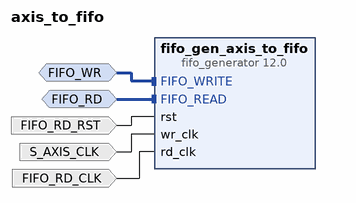
[diagram p0: block diagram of the top level]
# Vivado block design axis_to_fifo, Vivado 2014.4
create_bd_design axis_to_fifo

create_bd_intf_port -mode Slave -vlnv xilinx.com:interface:fifo_write_rtl:1.0 FIFO_WR
create_bd_intf_port -mode Slave -vlnv xilinx.com:interface:fifo_read_rtl:1.0 FIFO_RD
create_bd_port -dir I FIFO_RD_RST
create_bd_port -dir I S_AXIS_CLK
create_bd_port -dir I FIFO_RD_CLK

create_bd_cell -type ip -vlnv xilinx.com:ip:fifo_generator:12.0 fifo_gen_axis_to_fifo
set_property -dict [list \
  CONFIG.Fifo_Implementation Independent_Clocks_Block_RAM \
  CONFIG.synchronization_stages 3 \
  CONFIG.Input_Data_Width 32 \
  CONFIG.Output_Data_Width 32 \
  CONFIG.Full_Flags_Reset_Value 1 \
  CONFIG.Use_Dout_Reset true \
] [get_bd_cells fifo_gen_axis_to_fifo]

# ---- connections ----

connect_bd_intf_net [get_bd_intf_ports FIFO_WR] [get_bd_intf_pins fifo_gen_axis_to_fifo/FIFO_WRITE]
connect_bd_intf_net [get_bd_intf_ports FIFO_RD] [get_bd_intf_pins fifo_gen_axis_to_fifo/FIFO_READ]
connect_bd_net -net rst_1 [get_bd_ports FIFO_RD_RST] [get_bd_pins fifo_gen_axis_to_fifo/rst]
connect_bd_net -net wr_clk_1 [get_bd_ports S_AXIS_CLK] [get_bd_pins fifo_gen_axis_to_fifo/wr_clk]
connect_bd_net -net rd_clk_1 [get_bd_ports FIFO_RD_CLK] [get_bd_pins fifo_gen_axis_to_fifo/rd_clk]

validate_bd_design
save_bd_design
